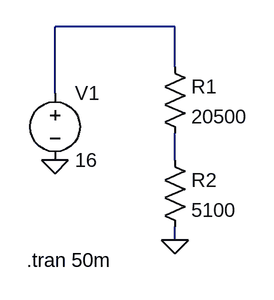
[diagram p0: schematic InputVoltageDivider.asc]
InputVoltageDivider.asc, the LTspice schematic file:
Version 4
SHEET 1 880 680
WIRE 80 32 -64 32
WIRE 80 80 80 32
WIRE -64 112 -64 32
WIRE 80 192 80 160
WIRE 80 288 80 272
FLAG 80 288 0
FLAG -64 192 0
SYMBOL res 64 64 R0
SYMATTR InstName R1
SYMATTR Value 20500
SYMBOL res 64 176 R0
SYMATTR InstName R2
SYMATTR Value 5100
SYMBOL voltage -64 96 R0
WINDOW 123 0 0 Left 0
WINDOW 39 0 0 Left 0
SYMATTR InstName V1
SYMATTR Value 16
TEXT -98 312 Left 2 !.tran 50m

The netlist it stands for:
* InputVoltageDivider.asc
R1 N001 N002 20500
R2 N002 0 5100
V1 N001 0 16
.tran 50m
.backanno
.end